# EAGLE schematic VolCon_ENC (EAGLE 6.5.0)
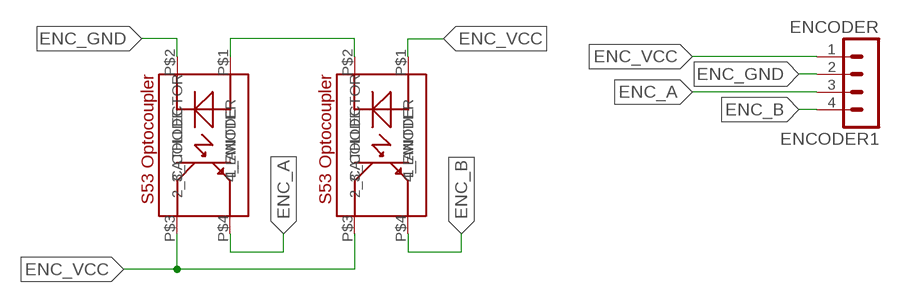
[diagram p0: schematic, sheet 1]

## Parts
ENCODER1  ENCODER  MA04-1  [MA04-1]
U$3  SHARP_S53  [SHARP_S53]
U$4  SHARP_S53  [SHARP_S53]

## Nets
ENC_A: ENCODER1.3 U$4.P$4(4_EMITTER)
ENC_B: ENCODER1.4 U$3.P$4(4_EMITTER)
ENC_GND: ENCODER1.2 U$4.P$2(2_CATHODE)
ENC_VCC: ENCODER1.1 U$3.P$1(1_ANODE) U$3.P$3(3_COLLECTOR) U$4.P$3(3_COLLECTOR)
N$9: U$3.P$2(2_CATHODE) U$4.P$1(1_ANODE)

## Library data of the parts
ENCODER1 = con-lstb:MA04-1: PIN HEADER; OC_FARNELL: unknown; OC_NEWARK: unknown
U$3 U$4 = SHARP_S53:SHARP_S53